# EAGLE schematic bij mekaar roopzol (EAGLE 5.00)
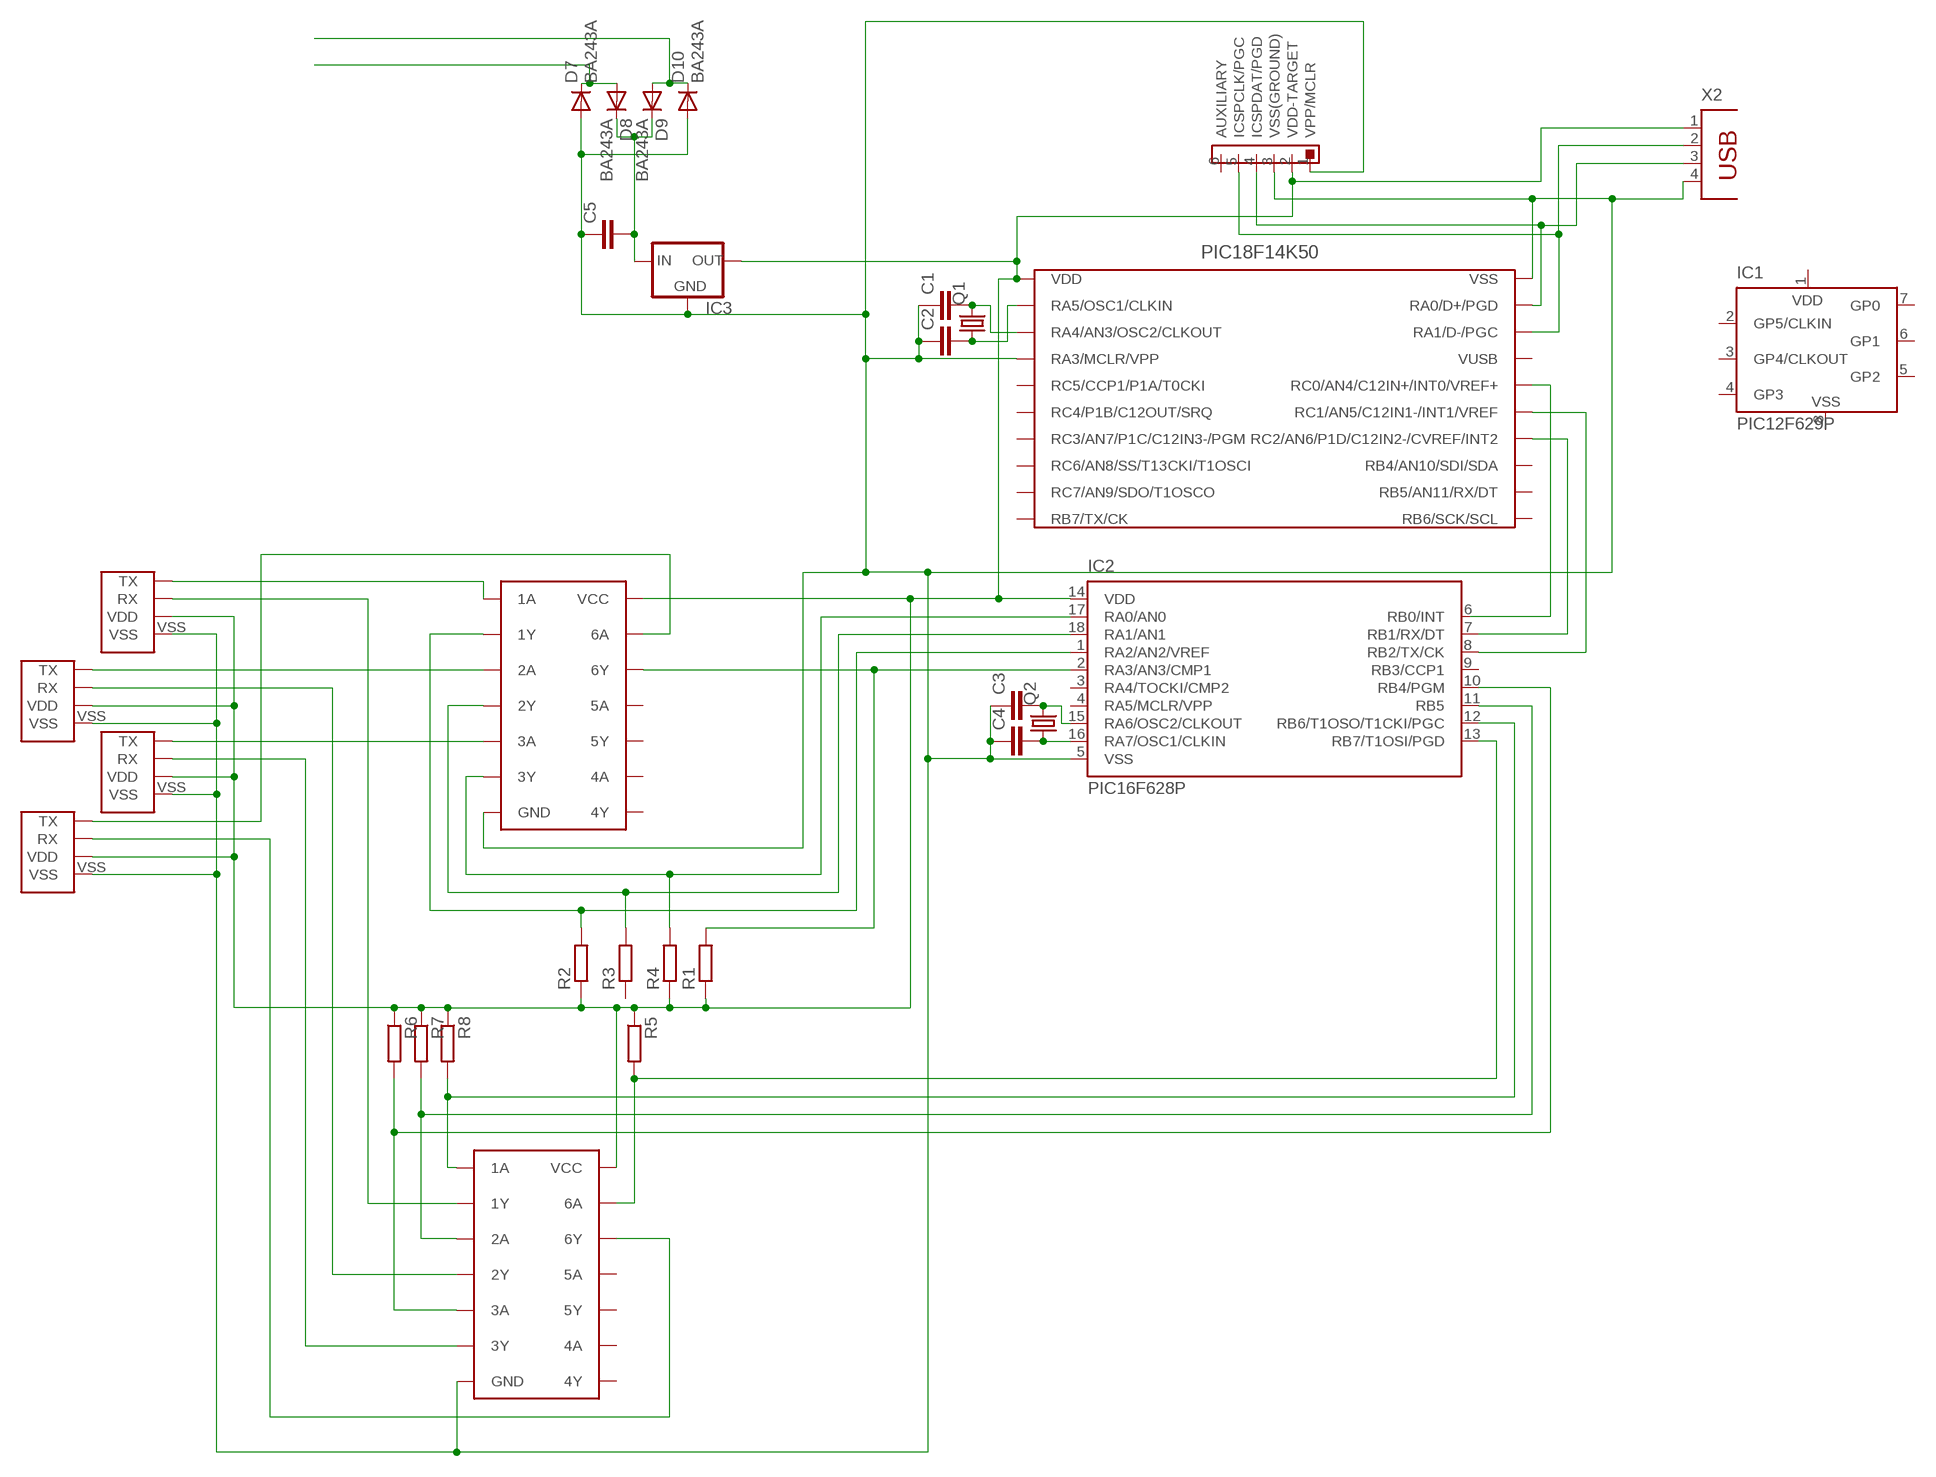
[diagram p0: schematic, sheet 1]

## Parts
C1  C2.5/2  [C2.5-2]
C2  C2.5/2  [C2.5-2]
C3  C2.5/2  [C2.5-2]
C4  C2.5/2  [C2.5-2]
C5  C2.5/4  [C2.5-4]
D7  BA243A  [DO35-10]
D8  BA243A  [DO35-10]
D9  BA243A  [DO35-10]
D10  BA243A  [DO35-10]
IC1  PIC12F629P  [DIL8]
IC2  PIC16F628P  [DIL18]
IC3  78XXS  [78XXS]
Q1  CRYSTALHC49S  [HC49/S]
Q2  CRYSTALHC49S  [HC49/S]
R1  R-EU_0204/7  [0204/7]
R2  R-EU_0204/7  [0204/7]
R3  R-EU_0204/7  [0204/7]
R4  R-EU_0204/7  [0204/7]
R5  R-EU_0204/7  [0204/7]
R6  R-EU_0204/7  [0204/7]
R7  R-EU_0204/7  [0204/7]
R8  R-EU_0204/7  [0204/7]
U$1  D.2.18F14K50  [E.18F14K50]
U$2  D.1.PICKIT-2-CONNECTOR  [P.1.PICKIT-CONNECTOR]
U$3  DATA-STEKKER  [P-DIP]
U$4  DATA-STEKKER  [P-DIP]
U$5  DATA-STEKKER  [P-DIP]
U$6  DATA-STEKKER  [P-DIP]
U$8  SN74LS14N  [P-DIP]
U$10  SN74LS14N  [P-DIP]
X2  PN61729  [PN61729]

## Nets
N$1: U$1.RA1/D-/PGC U$2.5(ICSPCLK/PGC) X2.2
N$2: U$1.RA0/D+/PGD U$2.4(ICSPDAT/PGD) X2.3
N$3: U$3.RX U$10.1Y
N$4: D7.C D8.A
N$5: C5.2 D8.C D9.C IC3.IN
N$6: U$3.TX U$8.1A
N$7: U$6.TX U$8.2A
N$8: D9.A D10.C
N$9: C1.2 Q1.2 U$1.RA4/AN3/OSC2/CLKOUT
N$11: U$5.TX U$8.3A
N$12: C3.2 IC2.15(RA6/OSC2/CLKOUT) Q2.2
N$13: C4.2 IC2.16(RA7/OSC1/CLKIN) Q2.1
N$14: IC2.8(RB2/TX/CK) U$1.RC1/AN5/C12IN1-/INT1/VREF
N$15: IC2.7(RB1/RX/DT) U$1.RC2/AN6/P1D/C12IN2-/CVREF/INT2
N$16: U$1.RC0/AN4/C12IN+/INT0/VREF+
N$17: C1.1 C2.1 C3.1 C4.1 C5.1 D7.A D10.A IC2.5(VSS) IC3.GND U$1.RA3/MCLR/VPP U$1.VSS U$2.1(VPP/MCLR) U$2.3(VSS(GROUND)) U$3.VSS U$4.VSS U$5.VSS U$6.VSS U$8.GND U$10.GND X2.4
N$18: U$4.TX U$8.6A
N$19: IC2.17(RA0/AN0) R4.2 U$8.3Y
N$20: IC2.18(RA1/AN1) R3.2 U$8.2Y
N$21: IC2.1(RA2/AN2/VREF) R2.2 U$8.1Y
N$22: IC2.2(RA3/AN3/CMP1) R1.2 U$8.6Y
N$23: IC2.13(RB7/T1OSI/PGD) R5.2 U$10.6A
N$24: IC2.10(RB4/PGM) R6.2 U$10.3A
N$25: U$6.RX U$10.2Y
N$26: U$5.RX U$10.3Y
N$27: U$4.RX U$10.6Y
N$28: C2.2 Q1.1 U$1.RA5/OSC1/CLKIN
N$29: IC2.12(RB6/T1OSO/T1CKI/PGC) R8.2 U$10.1A
N$30: IC2.11(RB5) R7.2 U$10.2A
N$33: IC2.14(VDD) IC3.OUT R1.1 R2.1 R4.1 R5.1 R6.1 R7.1 R8.1 U$1.VDD U$2.2(VDD-TARGET) U$3.VDD U$4.VDD U$5.VDD U$6.VDD U$8.VCC U$10.VCC X2.1
Unconnected: IC1.2(GP5/CLKIN) IC1.3(GP4/CLKOUT) IC1.4(GP3) IC1.5(GP2) IC1.6(GP1) IC1.7(GP0) IC2.3(RA4/TOCKI/CMP2) IC2.4(RA5/MCLR/VPP) IC2.6(RB0/INT) IC2.9(RB3/CCP1) R3.1 U$1.RB4/AN10/SDI/SDA U$1.RB5/AN11/RX/DT U$1.RB6/SCK/SCL U$1.RB7/TX/CK U$1.RC3/AN7/P1C/C12IN3-/PGM U$1.RC4/P1B/C12OUT/SRQ U$1.RC5/CCP1/P1A/T0CKI U$1.RC6/AN8/SS/T13CKI/T1OSCI U$1.RC7/AN9/SDO/T1OSCO U$1.VUSB U$2.6(AUXILIARY) U$8.4A U$8.4Y U$8.5A U$8.5Y U$10.4A U$10.4Y U$10.5A U$10.5Y

## Power pins joined to a net without a drawn wire
VDD: IC1.1(VDD)
VSS: IC1.8(VSS)

## Library data of the parts
C1-C5 = capacitor-wima:C: CAPACITOR naming: grid - package width
D7-D10 = diode:BA243A: DIODE
IC1 = microchip:PIC12F6*: Data Sheet 8-Pin FLASH-Based 8-Bit CMOS Microcontrollers Source: http://www.microchip.com .. 41190c.pdf
IC2 = microchip:PIC16F62*: FLASH-Based 8-Bit CMOS Microcontroller Source: http://ww1.microchip.com/downloads/en/DeviceDoc/40300C.pdf
IC3 = v-reg:78XXS: VOLTAGE REGULATOR
Q1 Q2 = crystal:CRYSTAL: CRYSTAL
R1-R8 = resistor:R-EU_: RESISTOR, European symbol
U$1 = pic18f14k50:D.2.18F14K50
U$2 = pickit-2-connector:D.1.PICKIT-2-CONNECTOR
U$3-U$6 = data-stekker:DATA-STEKKER
U$8 U$10 = synergy:SN74LS14N
X2 = con-berg:PN61729: BERG USB connector